# EAGLE design schematic (EAGLE 7.5.0)
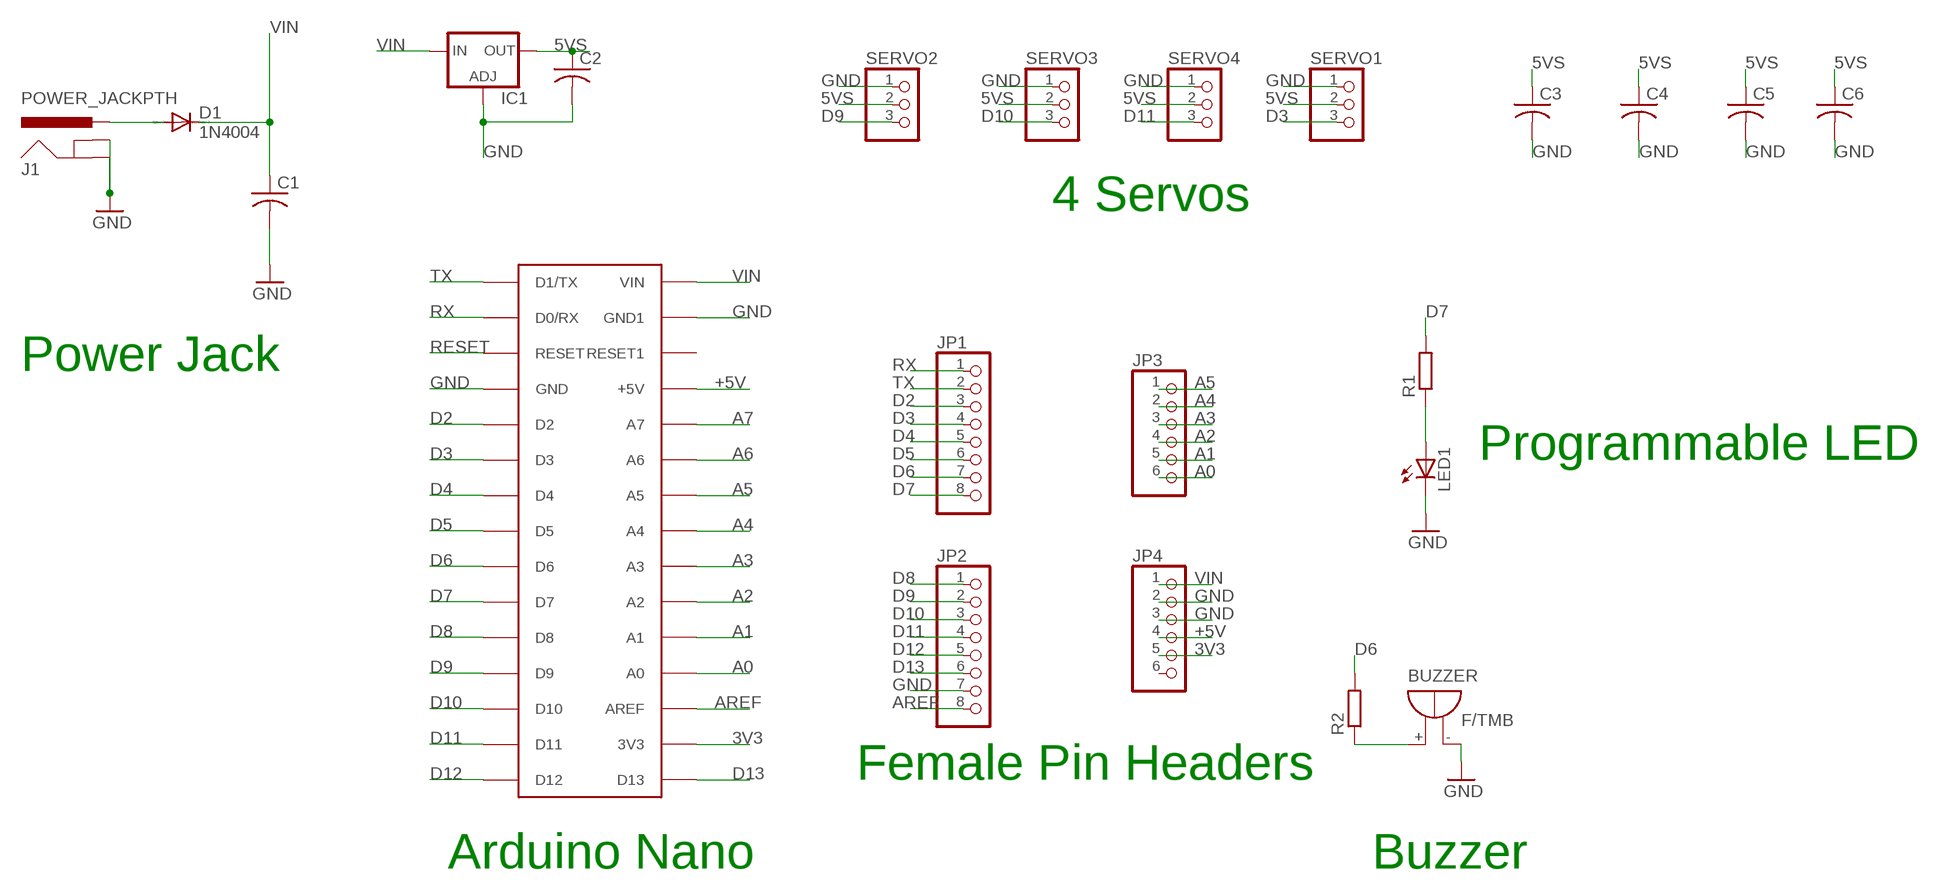
[diagram p0: schematic, sheet 1]

## Parts
BUZZER  F/TMB  [F/TMB]
C1  C-USC1206  [C1206]
C2  C-USC1206  [C1206]
C3  C-USC0805  [C0805]
C4  C-USC0805  [C0805]
C5  C-USC0805  [C0805]
C6  C-USC0805  [C0805]
D1  1N4004  [DO41-10]
IC1  LD117AS33TR  [SOT223]
J1  POWER_JACKPTH  [POWER_JACK_PTH]
JP1  PINHD-1X8  [1X08]
JP2  PINHD-1X8  [1X08]
JP3  PINHD-1X6  [1X06]
JP4  PINHD-1X6  [1X06]
LED1  LED5MM  [LED5MM]
R1  R-EU_0207/10  [0207/10]
R2  R-EU_0207/10  [0207/10]
SERVO1  PINHD-1X3  [1X03]
SERVO2  PINHD-1X3  [1X03]
SERVO3  PINHD-1X3  [1X03]
SERVO4  PINHD-1X3  [1X03]
U$1  ARDUINONANO  [PDIP-32]

## Nets
3V3: JP4.5 U$1.3V3
5VS: C2.1 C3.1 C4.1 C5.1 C6.1 IC1.4(OUT) SERVO1.2 SERVO2.2 SERVO3.2 SERVO4.2
+5V: JP4.4 U$1.+5V
A0: JP3.6 U$1.A7(A0)
A1: JP3.5 U$1.A6(A1)
A2: JP3.4 U$1.A5(A2)
A3: JP3.3 U$1.A4(A3)
A4: JP3.2 U$1.A3(A4)
A5: JP3.1 U$1.A2(A5)
A6: U$1.A1(A6)
A7: U$1.A0(A7)
AREF: JP2.8 U$1.AREF
D2: JP1.3 U$1.D2
D3: JP1.4 SERVO1.3 U$1.D3
D4: JP1.5 U$1.D4
D5: JP1.6 U$1.D5
D6: JP1.7 R2.2 U$1.D6
D7: JP1.8 R1.2 U$1.D7
D8: JP2.1 U$1.D8
D9: JP2.2 SERVO2.3 U$1.D9
D10: JP2.3 SERVO3.3 U$1.D10
D11: JP2.4 SERVO4.3 U$1.D11
D12: JP2.5 U$1.D12
D13: JP2.6 U$1.D13
GND: BUZZER.- C1.2 C2.2 C3.2 C4.2 C5.2 C6.2 IC1.1(ADJ) J1.GND J1.GNDBREAK JP2.7 JP4.2 JP4.3 LED1.K(C) SERVO1.1 SERVO2.1 SERVO3.1 SERVO4.1 U$1.GND U$1.GND1
N$1: LED1.A R1.1
N$2: D1.A J1.PWR
N$4: BUZZER.+ R2.1
RESET: U$1.RESET
RX: JP1.1 U$1.D0/RX
TX: JP1.2 U$1.D1/TX
VIN: C1.1 D1.C IC1.3(IN) JP4.1 U$1.VIN
Unconnected: JP4.6 U$1.RESET1

## Notes on the sheet
- 4 Servos
- Power Jack
- Programmable LED
- Female Pin Headers
- Arduino Nano | Buzzer

## Library data of the parts
BUZZER = buzzer:F/TMB: BUZZER Source: Buerklin; OC_FARNELL: unknown; OC_NEWARK: unknown
C1-C6 = adafruit:C-US: CAPACITOR, American symbol
D1 = diode:1N4004: DIODE general purpose rectifier, 1 A
IC1 = v-reg:LD117A?*: Low drop fixed and adjustable positive voltage regulators 1 A Source: http://www.st.com/stonline/products/literature/ds/7194/ld1117axx.pdf
J1 = SparkFun:POWER_JACK: Power Jack This is the standard 5.5mm barrel jack for power. The PTH is the most common, proven, reliable, footprint. All others are experimental. The Slot footprint only works if the mill layer is transmitted to the PCB fab house so be warned. Spark Fun Electronics SKU : PRT-00119. Mating wall wart : TOL-00298 (and others)
JP1 JP2 = pinhead:PINHD-1X8: PIN HEADER
JP3 JP4 = pinhead:PINHD-1X6: PIN HEADER
LED1 = led:LED: LED OSRAM: - CHIPLED LG R971, LG N971, LY N971, LG Q971, LY Q971, LO R971, LY R971 LH N974, LH R974 LS Q976, LO Q976, LY Q976 LO Q996 - Hyper CHIPLED LW Q18S LB Q993, LB Q99A, LB R99A - SideLED LS A670, LO A670, LY A670, LG A670, LP A670 LB A673, LV A673, LT A673, LW A673 LH A674 LY A675 LS A676, LA A676, LO A676, LY A676, LW A676 LS A679, LY A679, LG A679 - Hyper Micro SIDELED® LS Y876, LA Y876, LO Y876, LY Y876 LT Y87S - SmartLED LW L88C, LW L88S LB L89C, LB L89S, LG L890 LS L89K, LO L89K, LY L89K LS L896, LA L896, LO L896, LY L896 - TOPLED LS T670, LO T670, LY T670, LG T670, LP T670 LSG T670, LSP T670, LSY T670, LOP T670, LYG T670 LG T671, LOG T671, LSG T671 LB T673, LV T673, LT T673, LW T673 LH T674 LS T676, LA T676, LO T676, LY T676, LB T676, LH T676, LSB T676, LW T676 LB T67C, LV T67C, LT T67C, LS T67K, LO T67K, LY T67K, LW E67C LS E67B, LA E67B, LO E67B, LY E67B, LB E67C, LV E67C, LT E67C LW T67C LS T679, LY T679, LG T679 LS T770, LO T770, LY T770, LG T770, LP T770 LB T773, LV T773, LT T773, LW T773 LH T774 LS E675, LA E675, LY E675, LS T675 LS T776, LA T776, LO T776, LY T776, LB T776 LHGB T686 LT T68C, LB T68C - Hyper Mini TOPLED® LB M676 - Mini TOPLED Santana® LG M470 LS M47K, LO M47K, LY M47K Source: http://www.osram.convergy.de LUXEON: - LUMILED® LXK2-PW12-R00, LXK2-PW12-S00, LXK2-PW14-U00, LXK2-PW14-V00 LXK2-PM12-R00, LXK2-PM12-S00, LXK2-PM14-U00 LXK2-PE12-Q00, LXK2-PE12-R00, LXK2-PE12-S00, LXK2-PE14-T00, LXK2-PE14-U00 LXK2-PB12-K00, LXK2-PB12-L00, LXK2-PB12-M00, LXK2-PB14-N00, LXK2-PB14-P00, LXK2-PB14-Q00 LXK2-PR12-L00, LXK2-PR12-M00, LXK2-PR14-Q00, LXK2-PR14-R00 LXK2-PD12-Q00, LXK2-PD12-R00, LXK2-PD12-S00 LXK2-PH12-R00, LXK2-PH12-S00 LXK2-PL12-P00, LXK2-PL12-Q00, LXK2-PL12-R00 Source: www.luxeon.com KINGBRIGHT: KA-3528ASYC Source: www.kingbright.com
R1 R2 = rcl:R-EU_: RESISTOR, European symbol
SERVO1-SERVO4 = pinhead:PINHD-1X3: PIN HEADER
U$1 = rocketfarm:ARDUINONANO

## Board
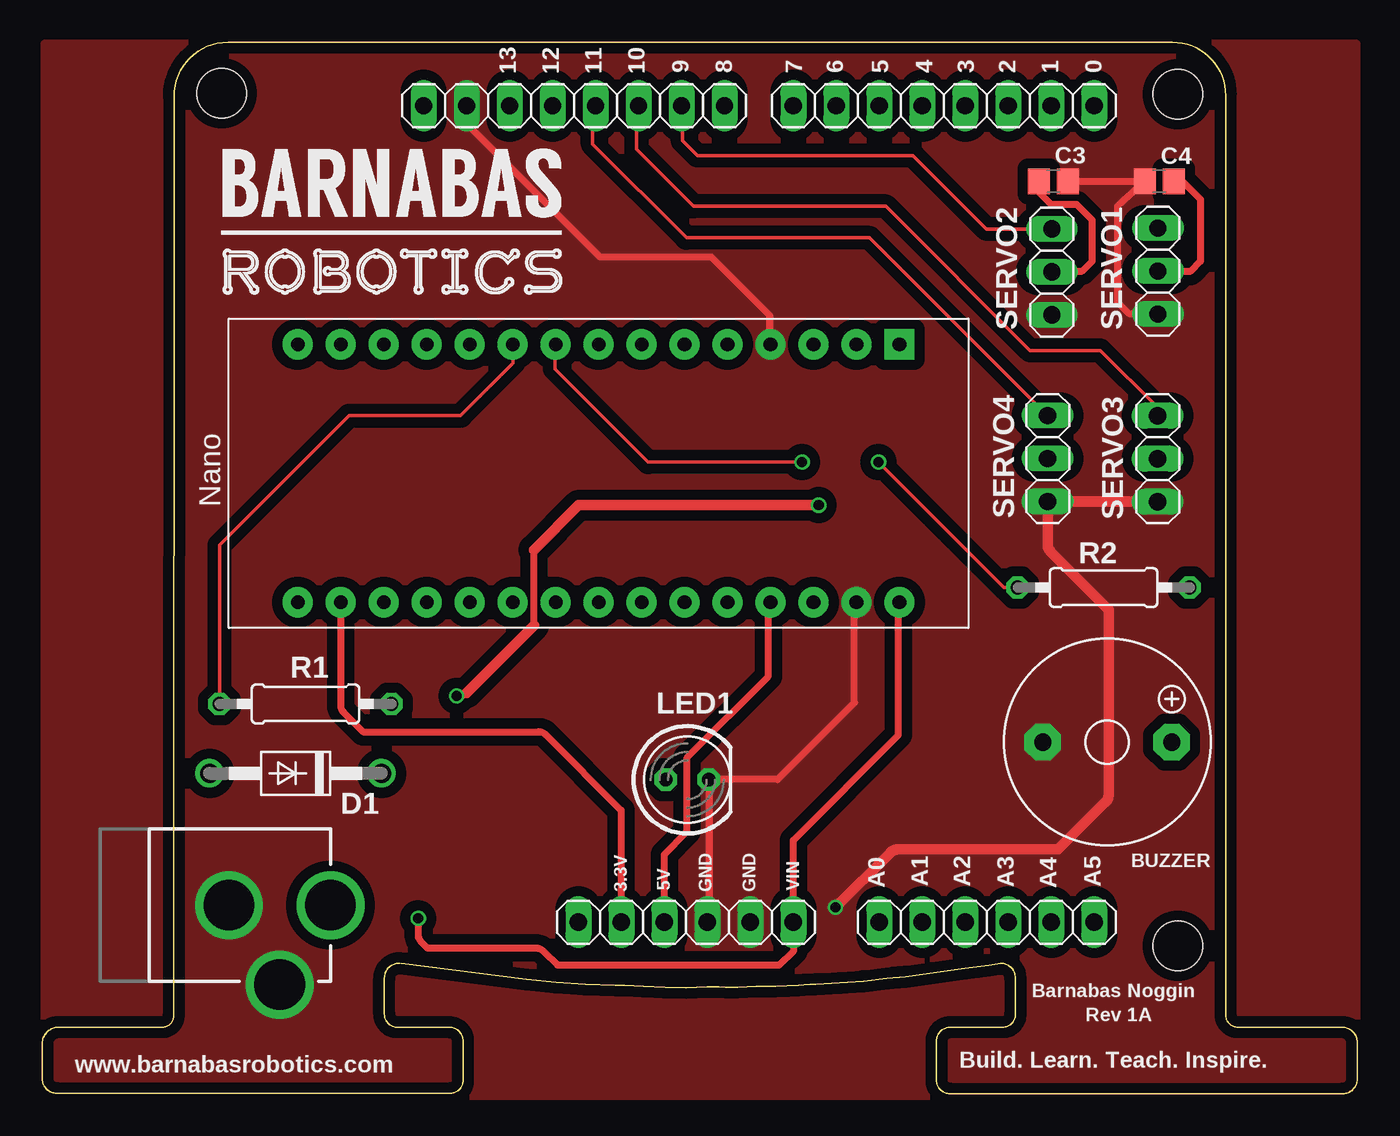
[diagram p1: board, top side]
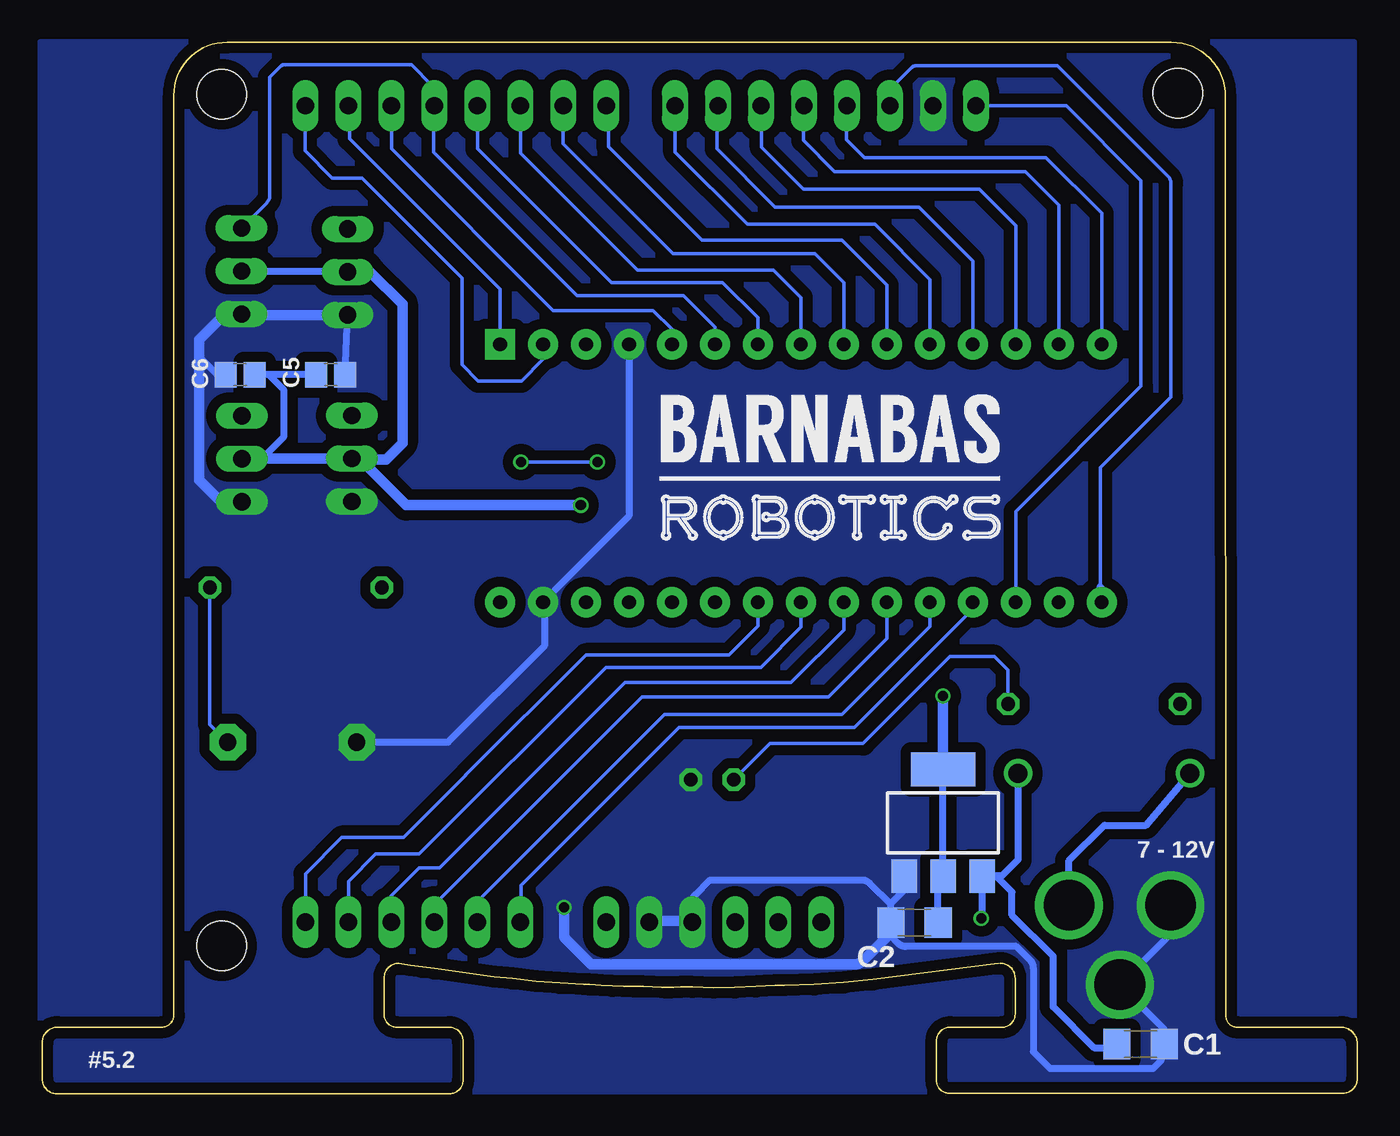
[diagram p2: board, bottom side, seen from below]

Size 77.7 x 62.13 mm. Coordinates in mm from the lower left corner, seen from the top.
Outline: 21.1,7.71 arc90 20.21,6.82 20.21,4.7 arc90 20.99,3.92 24.07,3.92 arc-90 24.86,3.13 24.86,0.76 arc-90 24.13,0.03 0.83,0.03 arc-90 0,0.86 0,2.97 arc-90 0.96,3.93 7.11,3.93 arc90 7.76,4.58 7.78,58.94 arc-90 10.97,62.13 66.79,62.13 arc-90 69.93,58.99 69.93,4.64 arc90 70.64,3.93 76.8,3.93 arc-90 77.7,3.03 77.7,0.84 arc-90 76.86,0 53.62,0 arc-90 52.84,0.78 52.84,3.08
Outline: 56.63,7.71 arc-90 57.5,6.84 57.5,4.66 arc-90 56.77,3.93 53.66,3.93 arc90 52.84,3.11 52.84,3.1
Outline: 21.2,7.69 28.63,6.75 arc7 33.83,6.41 arc-4 35.54,6.34 arc8 39.28,6.3 arc-7 40.36,6.29 arc9 41.1,6.29 arc-5 42.71,6.34 arc5 44.67,6.41 arc-3 45.71,6.47 arc6 49.92,6.81 arc-4 51,6.91
Outline: 51.01,6.91 54.53,7.39 arc2 56.64,7.71
Copper layers (1*16): Top 0.035mm / dielectric 1.5mm / Bottom 0.035mm
Design rules "EagleRules": minimum track width 7mil, minimum drill 12mil, track to track 7mil, track to pad 7mil, pad to pad 7mil, via to via 7mil, smd to smd 0mil, copper to edge 20mil, drill to drill 10mil, minimum pad ring 10mil, minimum via ring 6mil, stop-mask expansion 2mil, vias tented up to drill 25mil, thermal gap 10mil
Holes 2.9 mm at 10.6,59.12 67.1,59.06 67.1,8.73

### Footprints (pad centres in the part's own frame; a part is rotated, then mirrored left to right if it is on the bottom)
F/TMB = drill 1.016 pad 2.159 octagon: + 3.81,0; - -3.81,0
C1206 = smd 1.6 x 1.8: 1 -1.4,0; 2 1.4,0
C0805 = smd 1.3 x 1.5: 1 -0.85,0; 2 0.85,0
DO41-10 = drill 1.118: A 5.08,0; C -5.08,0
SOT223 = smd 1.5 x 2: 1 -2.3,-3.15; 2 0,-3.15; 3 2.3,-3.15 | smd 3.8 x 2: 4 0,3.15
POWER_JACK_PTH = drill 2.997: GND 0,7.7; GNDBREAK 4.7,10.7; PWR 0,13.7
1X08 = drill 1.016 long: 1 -8.89,0; 2 -6.35,0; 3 -3.81,0; 4 -1.27,0; 5 1.27,0; 6 3.81,0; 7 6.35,0; 8 8.89,0
1X06 = drill 1.016 long: 1 -6.35,0; 2 -3.81,0; 3 -1.27,0; 4 1.27,0; 5 3.81,0; 6 6.35,0
LED5MM = drill 0.813 octagon: A -1.27,0; K 1.27,0
0207/10 = drill 0.813 octagon: 1 -5.08,0; 2 5.08,0
1X03 = drill 1.016 long: 1 -2.54,0; 2 0,0; 3 2.54,0
PDIP-32 = drill 0.8 pad 1.778: 3V3 15.24,-35.56; +5V 15.24,-10.16; A0 15.24,-12.7; A1 15.24,-15.24; A2 15.24,-17.78; A3 15.24,-20.32; A4 15.24,-22.86; A5 15.24,-25.4; A6 15.24,-27.94; A7 15.24,-30.48; AREF 15.24,-33.02; D0/RX 0,-5.08; D2 0,-12.7; D3 0,-15.24; D4 0,-17.78; D5 0,-20.32; D6 0,-22.86; D7 0,-25.4; D8 0,-27.94; D9 0,-30.48; D10 0,-33.02; D11 0,-35.56; D12 0,-38.1; D13 15.24,-38.1; GND 0,-10.16; GND1 15.24,-5.08; RESET 0,-7.62; RESET1 15.24,-7.62; VIN 15.24,-2.54 | drill 0.8 pad 1.778 square: D1/TX 0,-2.54

### Placement (x,y rotation side)
BUZZER  62.93,20.77 0 top
C1  12.8,2.93 0 bottom
C2  26.16,10.11 180 bottom
C3  59.75,53.92 0 top
C4  66,53.92 180 top
C5  60.67,42.49 0 bottom
C6  66,42.49 180 bottom
D1  14.97,18.93 180 top
IC1  24.47,16.01 0 bottom
J1  3.33,11.14 270 top
JP1  53.27,58.38 180 top
JP2  31.43,58.38 180 top
JP3  55.81,10.13 180 top
JP4  38.03,10.13 180 top
LED1  38.11,18.55 0 top
R1  15.55,23.03 180 top
R2  62.72,29.91 180 top
SERVO1  65.93,48.61 90 top
SERVO2  59.65,48.56 90 top
SERVO3  65.91,37.52 90 top
SERVO4  59.41,37.54 90 top
U$1  53.19,44.28 270 top

### Tracks (layer width: path | path; a pad name or v marks a point on that pad's centre or on a via)
3V3
  Top 0.406: U$1.3V3 17.63,22.97 arc45 17.82,22.52 18.95,21.39 29.31,21.39 arc-45 29.75,21.2 34.21,16.75 34.21,10.17 arc45 JP4.5
5VS  (via drill 0.6)
  Top 0.406: 29.05,27.67 29.05,32.13 | 24.62,23.51 arc45 25.07,23.69 | C4.1 67.37,53.92 68.44,52.85 68.44,49.2 67.83,48.59 65.95,48.59 SERVO1.2 | SERVO2.2 59.71,48.61 61.46,48.61 62.04,49.2 62.04,51.63 61.12,52.55 59.62,52.55 58.92,53.24 58.92,53.9 C3.1
  Top 0.61: 29.05,32.13 31.7,34.78 v45.88,34.78 | v24.48,23.51 24.62,23.51 | 25.07,23.69 29.05,27.67
  Bottom 0.406: 58.9,37.48 59.35,37.48 SERVO4.2 | C2.1 24.76,12.36 24.47,12.65 IC1.4 | SERVO3.2 65.89,37.54 64.7,37.54 63.41,38.83 63.41,41.57 64.33,42.49 | C5.1 64.33,42.49 | 64.33,42.49 C6.1 | SERVO1.2 59.71,48.61 SERVO2.2
  Bottom 0.61: v45.88,34.78 56.2,34.78 58.9,37.48 57.39,37.48 56.42,38.45 56.42,46.66 58.32,48.56 SERVO2.2 | SERVO4.2 65.89,37.54 | IC1.4 24.47,23.48 arc-45 v24.48,23.51
+5V
  Top 0.406: JP4.4 36.76,14.14 38.1,15.48 38.1,19.86 42.91,24.66 42.91,28.92 U$1.+5V
A0
  Bottom 0.203: U$1.A7 22.71,28.65 29.72,21.64 40.08,21.64 49.4,12.32 49.4,10.19 JP3.6
A1
  Bottom 0.203: U$1.A6 25.25,27.61 30.45,22.42 40.92,22.42 51.9,11.44 51.9,10.23 JP3.5
A2
  Bottom 0.203: U$1.A5 27.79,26.89 31.24,23.45 42.27,23.45 54.26,11.45 54.26,10.41 JP3.4
A3
  Bottom 0.203: U$1.A4 30.33,27.4 33.45,24.29 43.28,24.29 54.22,13.35 55.42,13.35 57.08,11.69 JP3.3
A4
  Bottom 0.203: U$1.A3 32.87,27.57 35.25,25.2 44.39,25.2 55.42,14.16 57.99,14.16 59.6,12.55 59.6,10.16 JP3.2
A5
  Bottom 0.203: U$1.A2 35.41,27.62 37.12,25.92 45.58,25.92 52.68,18.82 52.68,18.81 56.36,15.13 60.01,15.13 62.15,12.99 JP3.1
AREF
  Bottom 0.203: U$1.AREF 20.17,34.4 12.77,41.8 12.77,53.97 17.19,58.38 JP2.8
  Bottom 0.406: JP2.8
D2
  Bottom 0.203: U$1.D2 40.49,45.18 41.6,46.29 47.51,46.29 57.07,55.85 57.07,58.37
  Bottom 0.406: 57.07,58.37 JP1.3
D3
  Bottom 0.203: U$1.D3 37.95,45.29 39.82,47.16 46.11,47.16 54.58,55.63 54.58,58.34 | 54.65,59.57 55.88,60.79 63.46,60.79 arc-45 63.59,60.74 64.26,60.07 64.26,53.08 arc45 64.44,52.63 SERVO1.3
  Bottom 0.406: 54.58,58.34 JP1.4 54.65,58.5 54.65,59.57
D4
  Bottom 0.203: U$1.D4 35.41,45.84 37.5,47.93 44.07,47.93 51.98,55.84 51.98,58.37
  Bottom 0.406: 51.98,58.37 JP1.5
D5
  Bottom 0.203: U$1.D5 32.87,47.05 34.5,48.67 42.53,48.67 49.45,55.59 JP1.6
  Bottom 0.406: JP1.6
D6  (via drill 0.6)
  Top 0.203: R2.2 56.83,29.91 v49.41,37.32 | v44.9,37.32 35.8,37.32 30.29,42.83 30.29,44.24 U$1.D6
  Bottom 0.203: U$1.D6 30.33,47.94 32.04,49.65 40.44,49.65 46.94,56.15 46.94,58.36 | v49.41,37.32 v44.9,37.32
  Bottom 0.406: 46.94,58.36 JP1.7
D7
  Top 0.203: R1.2 10.47,32.42 18.12,40.06 24.72,40.06 27.83,43.17 27.83,44.24 U$1.D7
  Bottom 0.203: U$1.D7 27.79,47.77 30.46,50.44 38.72,50.44 44.25,55.96 44.25,58.26
  Bottom 0.406: 44.25,58.26 JP1.8
D8
  Bottom 0.203: U$1.D8 25.25,48.11 28.51,51.37 36.03,51.37 40.3,55.64 40.3,58.37
  Bottom 0.406: 40.3,58.37 JP2.1
D9
  Top 0.203: SERVO2.3 55.79,51.1 51.45,55.44 38.71,55.44 37.84,56.31 37.84,58.32
  Top 0.406: 37.84,58.32 JP2.2
  Bottom 0.203: U$1.D9 22.71,49.2 25.91,52.39 34.41,52.39 37.84,55.83 37.84,58.32
  Bottom 0.406: 37.84,58.32 JP2.2
D10
  Top 0.203: 65.91,40.53 62.52,43.92 58.36,43.92 49.84,52.43 38.49,52.43 35.1,55.83 35.1,57.79
  Top 0.406: SERVO3.3 65.91,40.53 | 35.1,57.79 35.2,57.88 35.2,58.34 JP2.3
  Bottom 0.203: U$1.D10 20.17,51.3 22.33,53.46 32.73,53.46 35.2,55.92 35.2,58.34
  Bottom 0.406: 35.2,58.34 JP2.3
D11
  Top 0.203: 59.4,40.08 48.89,50.58 38.06,50.58 32.52,56.12 32.52,58.2
  Top 0.406: SERVO4.3 59.4,40.08 | 32.52,58.2 JP2.4
  Bottom 0.203: U$1.D11 17.63,52.52 19.59,54.48 30.88,54.48 32.73,56.34 32.73,58.35
  Bottom 0.406: 32.73,58.35 JP2.4
D12
  Bottom 0.203: U$1.D12 15.09,52.02 18.39,55.32 29.11,55.32 30.18,56.39 30.18,58.36
  Bottom 0.406: 30.18,58.36 JP2.5
D13
  Bottom 0.203: 15.18,29.94 15.18,36.99 11,41.16 11,53.77 arc-45 11.19,54.22 17.71,60.74 26.09,60.74 arc-45 26.32,60.64 | 26.25,60.71 26.32,60.64 | 26.32,60.64 27.64,59.32
  Bottom 0.406: U$1.D13 15.09,29.85 15.18,29.94 | 27.64,59.32 27.64,58.41 JP2.6
GND  (via drill 0.6)
  Top 0.203: 42.98,44.33 U$1.GND
  Top 0.406: 65.89,35 SERVO3.1 | U$1.GND1 48,28.93 48,23.11 43.45,18.56 39.4,18.56 LED1.K 39.38,10.22 JP4.3 | JP2.7 25.08,57.32 32.94,49.45 39.53,49.45 42.98,46 42.98,44.33 | C3.2 C4.2 63.56,52.48 63.56,46.76 64.25,46.07 SERVO1.1
  Top 0.61: 65.89,35 SERVO4.1 59.41,32.46 arc45 59.6,32.01 63.02,28.59 63.02,17.68 arc-45 62.83,17.23 60.02,14.42 50.55,14.42 arc45 50.1,14.24 v46.87,11.01
  Bottom 0.406: SERVO1.1 65.87,46.02 66.98,46.02 | 67.15,34.98 SERVO3.1 | 39.38,10.22 JP4.3 39.3,11.3 arc45 39.11,11.75 38.24,12.62 29.27,12.62 arc45 28.82,12.44 27.58,11.21 | U$1.GND 43.03,34.12 U$1.GND1 48,28.93 48,26.49 53.71,20.77 BUZZER.- | J1.GND 11.03,9.44 J1.GNDBREAK 11.4,3.81 C1.2 11.67,2.5 11.59,2.42 11.59,1.95 12.05,1.49 18.15,1.49 19.14,2.48 19.14,7.43 arc-45 19.32,7.88 20.14,8.7 26.68,8.7 arc45 27.13,8.88 27.54,9.29 27.54,9.53 27.54,10.08 C2.2 27.58,10.12 | IC1.1 26.77,12.02 27.58,11.21 | 27.58,11.21 27.58,10.12 | 27.58,10.12 27.91,10.12 | C5.2 59.67,46 SERVO2.1 | C6.2 67.37,42.49 68.44,43.56
  Bottom 0.61: SERVO2.1 65.87,46.02 | 66.98,46.02 68.44,44.56 68.44,43.56 68.44,36.27 67.15,34.98 | v46.87,11.01 46.87,9.4 arc-45 46.76,9.13 45.28,7.65 29.68,7.65 arc-45 29.23,7.83 27.54,9.53 | 39.38,10.22 41.63,10.22 arc-45 JP4.2
  pour Top (isolate 0.61, rank 2, no thermals): 0.43,-0.15 77.69,-0.15 77.69,62.06 0.1,62.06 0.1,-0.17
  pour Bottom (isolate 0.61, rank 2, no thermals): 0.2,62.11 77.8,62.11 77.8,0.18 0.19,0.18 0.19,62.11
N$1
  Bottom 0.203: R1.1 20.63,25.02 21.43,25.82 24.07,25.82 29.2,20.69 34.7,20.69 LED1.A
N$2
  Bottom 0.406: J1.PWR 17.03,13.78 14.94,15.87 12.48,15.87 D1.A
N$4
  Bottom 0.203: R2.1 67.8,21.82 BUZZER.+
RX
  Bottom 0.203: U$1.D0/RX 48.11,43.4 49.39,42.12 51.94,42.12 52.9,43.09 52.9,48.21 58.8,54.11 60.57,54.11 62.18,55.72 62.18,58.36
  Bottom 0.406: 62.18,58.36 JP1.1
TX
  Bottom 0.203: U$1.D1/TX 50.65,47.53 59.54,56.43 59.54,58.31
  Bottom 0.406: 59.54,58.31 JP1.2
VIN  (via drill 0.6)
  Top 0.406: U$1.VIN 50.59,28.98 50.59,21.19 44.38,14.98 JP4.1 44.41,10.1 44.41,8.45 43.56,7.6 30.43,7.6 29.61,8.42 arc45 29.16,8.6 22.75,8.6 22.4,8.95 arc-45 22.21,9.4 v22.21,10.35
  Bottom 0.406: D1.C 20.04,13.82 21.01,12.86 21.34,12.86 | 21.34,12.86 IC1.3 22.17,10.4 v22.21,10.35 | 21.34,12.86 20.39,11.92 20.39,10.54 17.97,8.12 17.97,5.12 15.56,2.71 14.42,2.71 C1.1

### Text on the board
tPlace: 13 | 12 | 11 | 10 | 9 | 8 | 7 | 6 | 5 | 4 | 3 | 2 | 1 | 0 | 3.3V | 5V | GND | GND | VIN | A0 | A1 | A2 | A3 | A4 | A5 | Barnabas Noggin | Rev 1A | Build. Learn. Teach. Inspire. | www.barnabasrobotics.com
bPlace: 7 - 12V | #5.2